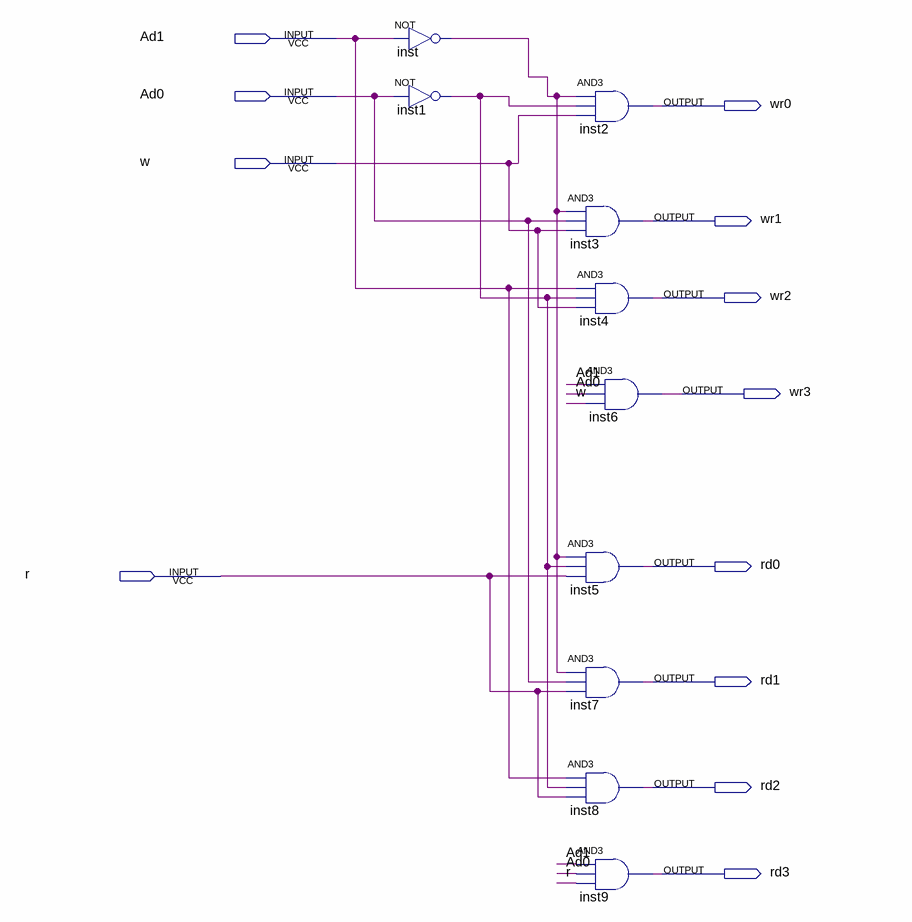
[diagram p0: schematic sheet]
// Quartus schematic logicDevre.bdf as structural Verilog: 10 symbols, 12 pins
module logicDevre (
  input  Ad1,
  input  Ad0,
  input  w,
  input  r,
  output wr0,
  output wr1,
  output wr2,
  output wr3,
  output rd0,
  output rd1,
  output rd2,
  output rd3
);

  wire inst1_out, inst_out;

  not inst (inst_out, Ad1);
  not inst1 (inst1_out, Ad0);
  and inst2 (wr0, inst_out, inst1_out, w);
  and inst3 (wr1, inst_out, Ad0, w);
  and inst4 (wr2, Ad1, inst1_out, w);
  and inst5 (rd0, inst_out, inst1_out, r);
  and inst7 (rd1, inst_out, Ad0, r);
  and inst8 (rd2, Ad1, inst1_out, r);
  and inst9 (rd3, Ad1, Ad0, r);
  and inst6 (wr3, Ad1, Ad0, w);
endmodule
